# Altium schematic sheet DMX.SchDoc
size A; DocumentNumber: 3; SheetNumber: 3; SheetTotal: 3
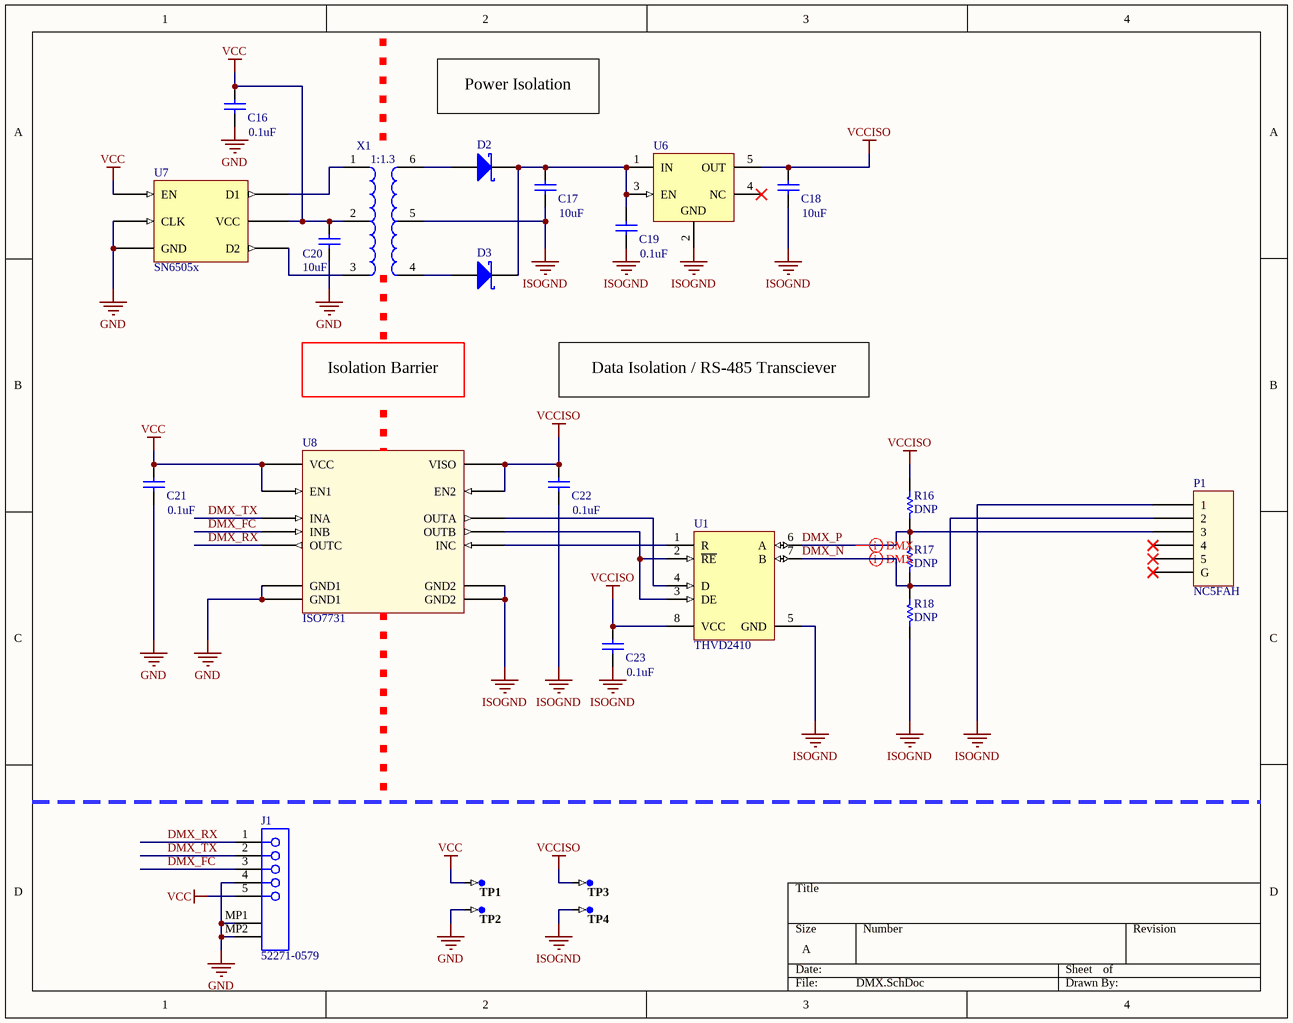
[diagram p0: DMX.SchDoc]

## Parts
C16  0.1uF  [CAPC0603(1608)100_L]
C17  10uF  [CAPC0603(1608)100_L]
C18  10uF  [CAPC0603(1608)100_L]
C19  0.1uF  [CAPC0603(1608)100_L]
C20  10uF  [CAPC0603(1608)100_L]
C21  0.1uF  [CAPC0603(1608)100_L]
C22  0.1uF  [CAPC0603(1608)100_L]
C23  0.1uF  [CAPC0603(1608)100_L]
D2  MBR0520L  [ONSC-SOD-123-2-425-04_V]  (value not drawn)
D3  MBR0520L  [ONSC-SOD-123-2-425-04_V]  (value not drawn)
J1  52271-0579  [MOLX-52271-0579]
P1  NC5FAH  [NC5FAH]
R16  DNP  [RESC0603(1608)_N]
R17  DNP  [RESC0603(1608)_N]
R18  DNP  [RESC0603(1608)_N]
TP1  TP-SM-C-100  [TP-SM-C-100]  (value not drawn)  (no BOM)
TP2  TP-SM-C-100  [TP-SM-C-100]  (value not drawn)  (no BOM)
TP3  TP-SM-C-100  [TP-SM-C-100]  (value not drawn)  (no BOM)
TP4  TP-SM-C-100  [TP-SM-C-100]  (value not drawn)  (no BOM)
U1  THVD2410  [D0008A_M]
U6  TPS76333DBVTG4  [TI-DBV5_M]  (value not drawn)
U7  SN6505x  [SOT-23-6]
U8  ISO7731  [SOIC (16)]
X1  750313638  [750313638]  (value not drawn)

## Nets
GND: C16.1 C20.1 C21.1 J1.4 J1.MP1 J1.MP2 TP2.1 U7.4(GND) U7.6(CLK) U8.2(GND1) U8.8(GND1)
ISOGND: C17.1 C18.1 C19.1 C22.1 C23.1 P1.1 R18.2 TP4.1 U1.5(GND) U6.2(GND) U8.9(GND2) U8.15(GND2) X1.5
VCC: C16.2 C20.2 C21.2 J1.5 TP1.1 U7.2(VCC) U7.5(EN) U8.1(VCC) U8.7(EN1) X1.2
VCCISO: C18.2 C22.2 C23.2 R16.1 TP3.1 U1.8(VCC) U6.5(OUT) U8.10(EN2) U8.16(VISO)
DMX_FC: J1.3 U8.4(INB)
DMX_N: P1.2 R17.1 R18.1 U1.7(B)
DMX_P: P1.3 R16.2 R17.2 U1.6(A)
DMX_RX: J1.1 U8.5(OUTC)
DMX_TX: J1.2 U8.3(INA)
NetC17_2: C17.2 C19.2 D2.1(K) D3.1(K) U6.1(IN) U6.3(EN)
NetD2_2: D2.2(A) X1.6
NetD3_2: D3.2(A) X1.4
NetU1_1: U1.1(R) U8.12(INC)
NetU1_2: U1.2(~{RE}) U1.3(DE) U8.13(OUTB)
NetU1_4: U1.4(D) U8.14(OUTA)
NetU7_1: U7.1(D1) X1.1
NetU7_3: U7.3(D2) X1.3

Not connected (* = marked no-connect by the designer): P1 4* 5* G*; U6 4(NC)*; U8 6(NC) 11(NC)

## Layout directives
differential pair: DMX_N, DMX_P

## Notes on the sheet
- Power Isolation
- Isolation Barrier
- Data Isolation / RS-485 Transciever
- (in symbol 750313638) 1:1.3

## Library data of the parts
C16-C23 = CMP-1035-00873-1: CAP 27pF 16V ±0.5pF 0603 (1608 Metric) Thickness 1mm SMD; Tolerance: Â±0.5pF; Case-Metric: 1608; Case-EIA: 0603; Value: 27pF; Max Thickness: 1 mm; Rated Voltage: 16 V; Technology: SMT
D2 D3 = CMP-2000-04926-1: Schottky Diode, 20V, 0.2A, 2-pin SOD-123, RoHS, Tape and Reel; Manufacturer: FairchildSemiconductor; Peak Forward Voltage: 0.385V; Rad Hard: No; Peak Non-Repetitive Surge Current: 5.5A; Peak Average Forward Current: 0.5A; Peak Reverse Current: 250uA; Configuration: Single; Mounting: SurfaceMount; Operating Temperature: -65to125degC; Datasheet URL: https://datasheet.ciiva.com/5739/1684450-5739282.pdf; Package Reference: SOD-123-2-425-04; Package Description: 2-Pin Small Outline Diode, Body 2.69 x 1.6 mm; Type: SchottkyDiode; Datasheet Version: Rev. C0, 03/2012; Manufacturer URL: https://www.fairchildsemi.com/; Peak Reverse Repetitive Voltage: 20V; Package: 2SOD-123; Packaging: Tape&Reel; Category: Rectifier
J1 = 52271-0579: 1.0 mm Pitch Easy-On(TM) Type FPC Connector, 3.0 mm Mated Height, Right Angle, ZIF, SMT, Bottom Contact, 5 Circuits, -40 to 85 degC, ELV and RoHS Compliant, Tape and Reel; Manufacturer: Molex; Circuits (Loaded): 5; Current (Max per Contact): 0.5A; Durability (mating cycles max): 30; Entry Angle: 90degrees Angle; Mated Height: 3.00mm; Material - Metal: Phosphor Bronze; Material - Plating Mating: Tin-Bismuth; PCB Locator: No; PCB Retention: Yes; Pitch - Mating Interface: 1.00mm; Voltage (Max): 50V AC (RMS)/DC; PackageVersion: Rev. B, 04/2004; PackageReference: 52271-0579; PackageDescription: 5-Lead FPC Connector, Pitch 1.0 mm; Supplier 1: Mouser; Supplier Part Number 1: 538-52271-0579; Contact Position: Bottom; Material - Plating Termination: Tin-Bismuth; Number of Rows: 1; Orientation: Right Angle; Packing: Tape and Reel; Pitch - Termination Interface: 1.00mm; Polarized to PCB: Yes; RoHS: TRUE; Stackable: No; Mounting Technology: Surface Mount; PartNumber: 52271-0579; ComponentLink1Description: Manufacturer URL; ComponentLink1URL: http://www.molex.com/molex/index.jsp; ComponentLink2Description: Datasheet; ComponentLink2URL: http://www.molex.com/webdocs/datasheets/pdf/en-us/0522710579_FFC_FPC_CONNECTORS.pdf; ComponentLink3Description: Package Specification; ComponentLink3URL: http://www.molex.com/pdm_docs/sd/522710579_sd.pdf
R16-R18 = CMP-1012-00133-1: 300K 0.1W 5% 0603 (1608 Metric)  SMD; Case-Metric: 1608; Case-EIA: 0603; Value: 300000.00 Ohm; Technology: SMT; Power: 0.1 W; Tolerance: 5 %
TP1-TP4 = CMP-0484-00002-2: Test Point, Surface Mount, Circular, Pad Diameter 1 mm; Manufacturer: No Vendor; PartNumber: TP-SM-C-100
U1 = CMP-0694-00004-2: 3.3 V Supply RS-485 with IEC ESD Protection, 0.25 Mbps, -40 to 125 degC, 8-Pin SOIC, RoHS, Tape and Reel; Manufacturer: Texas Instruments; PartNumber: SN65HVD72DR; VI: -7 to 12 V; No. of RX: 1; ICC (Max) (mA): 0.95; ESD: 15 kV; VCC: 3 to 3.6 V; Signaling Rate (Max) (Mbps): 0.25; Packing: Tape and Reel; PackageReference: D0008A; ComponentLink3URL: http://www.ti.com/lit/ds/sllse11c/sllse11c.pdf; RoHS: TRUE; Operating Temperature Range: -40 to 125 degC; ComponentLink1Description: Manufacturer URL; Mounting Technology: Surface Mount; ComponentLink1URL: http://www.ti.com/; ComponentLink3Description: Package Specification; No. of TX: 1; PackageDescription: 8-Pin Plastic Small Outline, Body 4.9 x 3.9 mm, Pitch 1.27 mm; ComponentLink2Description: Datasheet; DatasheetVersion: SLLSE11C; ComponentLink2URL: http://www.ti.com/lit/ds/sllse11c/sllse11c.pdf; PackageVersion: 4040047-3/M
U6 = CMP-0394-00562-1: Single Output LDO, 150 mA, Fixed 3.3 V Output, 2.7 to 10 V Input, with Low IQ, 5-pin SOT-23 (DBV), -40 to 125 degC, Green (RoHS & no Sb/Br); Manufacturer: Texas Instruments; Vin(Max)(V): 10; SubFamily: Single Channel LDO; Vout Adj(Max)(V): 3.3; Iq(Typ)(mA): 0.08; Accuracy(%): 3; Vin(Min)(V): 2.7; Vdo(Typ)(mV): 300; Iout(Max)(A): 0.15; PackageReference: DBV5; Eco-Plan: Green (RoHS & no Sb/Br); PackageDescription: 5-Pin Plastic Small Outline, Body 1.60 Ãƒâ€” 2.90 mm, Pitch 0.95 mm; Vout Adj(Min)(V): 3.3; DatasheetVersion: SLVS181H; ComponentLink2Description: Datasheet; ComponentLink3URL: http://www.ti.com/litv/pdf/mpds018i; Code_JEDEC: MO-178; ComponentLink1Description: Manufacturer URL; PackageVersion: 4073253-4/K; PartNumber: TPS76333DBVTG4; ComponentLink1URL: http://www.ti.com/; ComponentLink3Description: Package Specification; Mounting Technology: Surface Mount; ComponentLink2URL: http://www.ti.com/general/docs/lit/getliterature.tsp?genericPartNumber=TPS76333&fileType=pdf; Fixed Output Options(V): 3.3